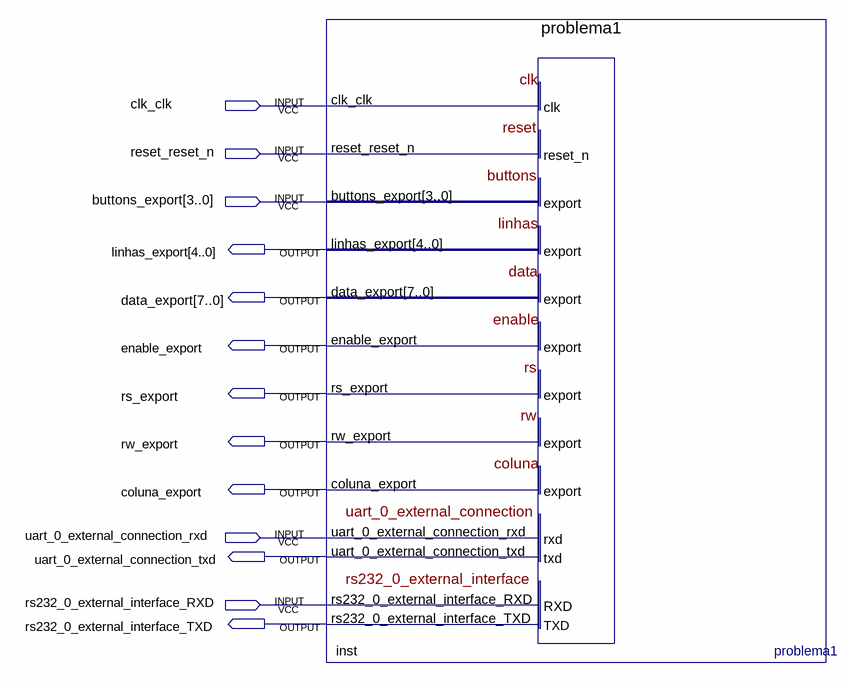
[diagram p0: schematic sheet]
// Quartus schematic txnorx.bdf as structural Verilog: 1 symbols, 13 pins
module txnorx (
  input  clk_clk,
  input  reset_reset_n,
  input  [3:0] buttons_export,
  input  uart_0_external_connection_rxd,
  input  rs232_0_external_interface_RXD,
  output [4:0] linhas_export,
  output [7:0] data_export,
  output enable_export,
  output rs_export,
  output rw_export,
  output coluna_export,
  output uart_0_external_connection_txd,
  output rs232_0_external_interface_TXD
);

  problema1 inst (
    .clk_clk(clk_clk), .reset_reset_n(reset_reset_n), .buttons_export(buttons_export),
    .uart_0_external_connection_rxd(uart_0_external_connection_rxd),
    .rs232_0_external_interface_RXD(rs232_0_external_interface_RXD), .linhas_export(linhas_export),
    .data_export(data_export), .enable_export(enable_export), .rs_export(rs_export), .rw_export(rw_export),
    .coluna_export(coluna_export), .uart_0_external_connection_txd(uart_0_external_connection_txd),
    .rs232_0_external_interface_TXD(rs232_0_external_interface_TXD));
endmodule
